# EAGLE design Mirror_ctrl_v1 (EAGLE 7.7.0)
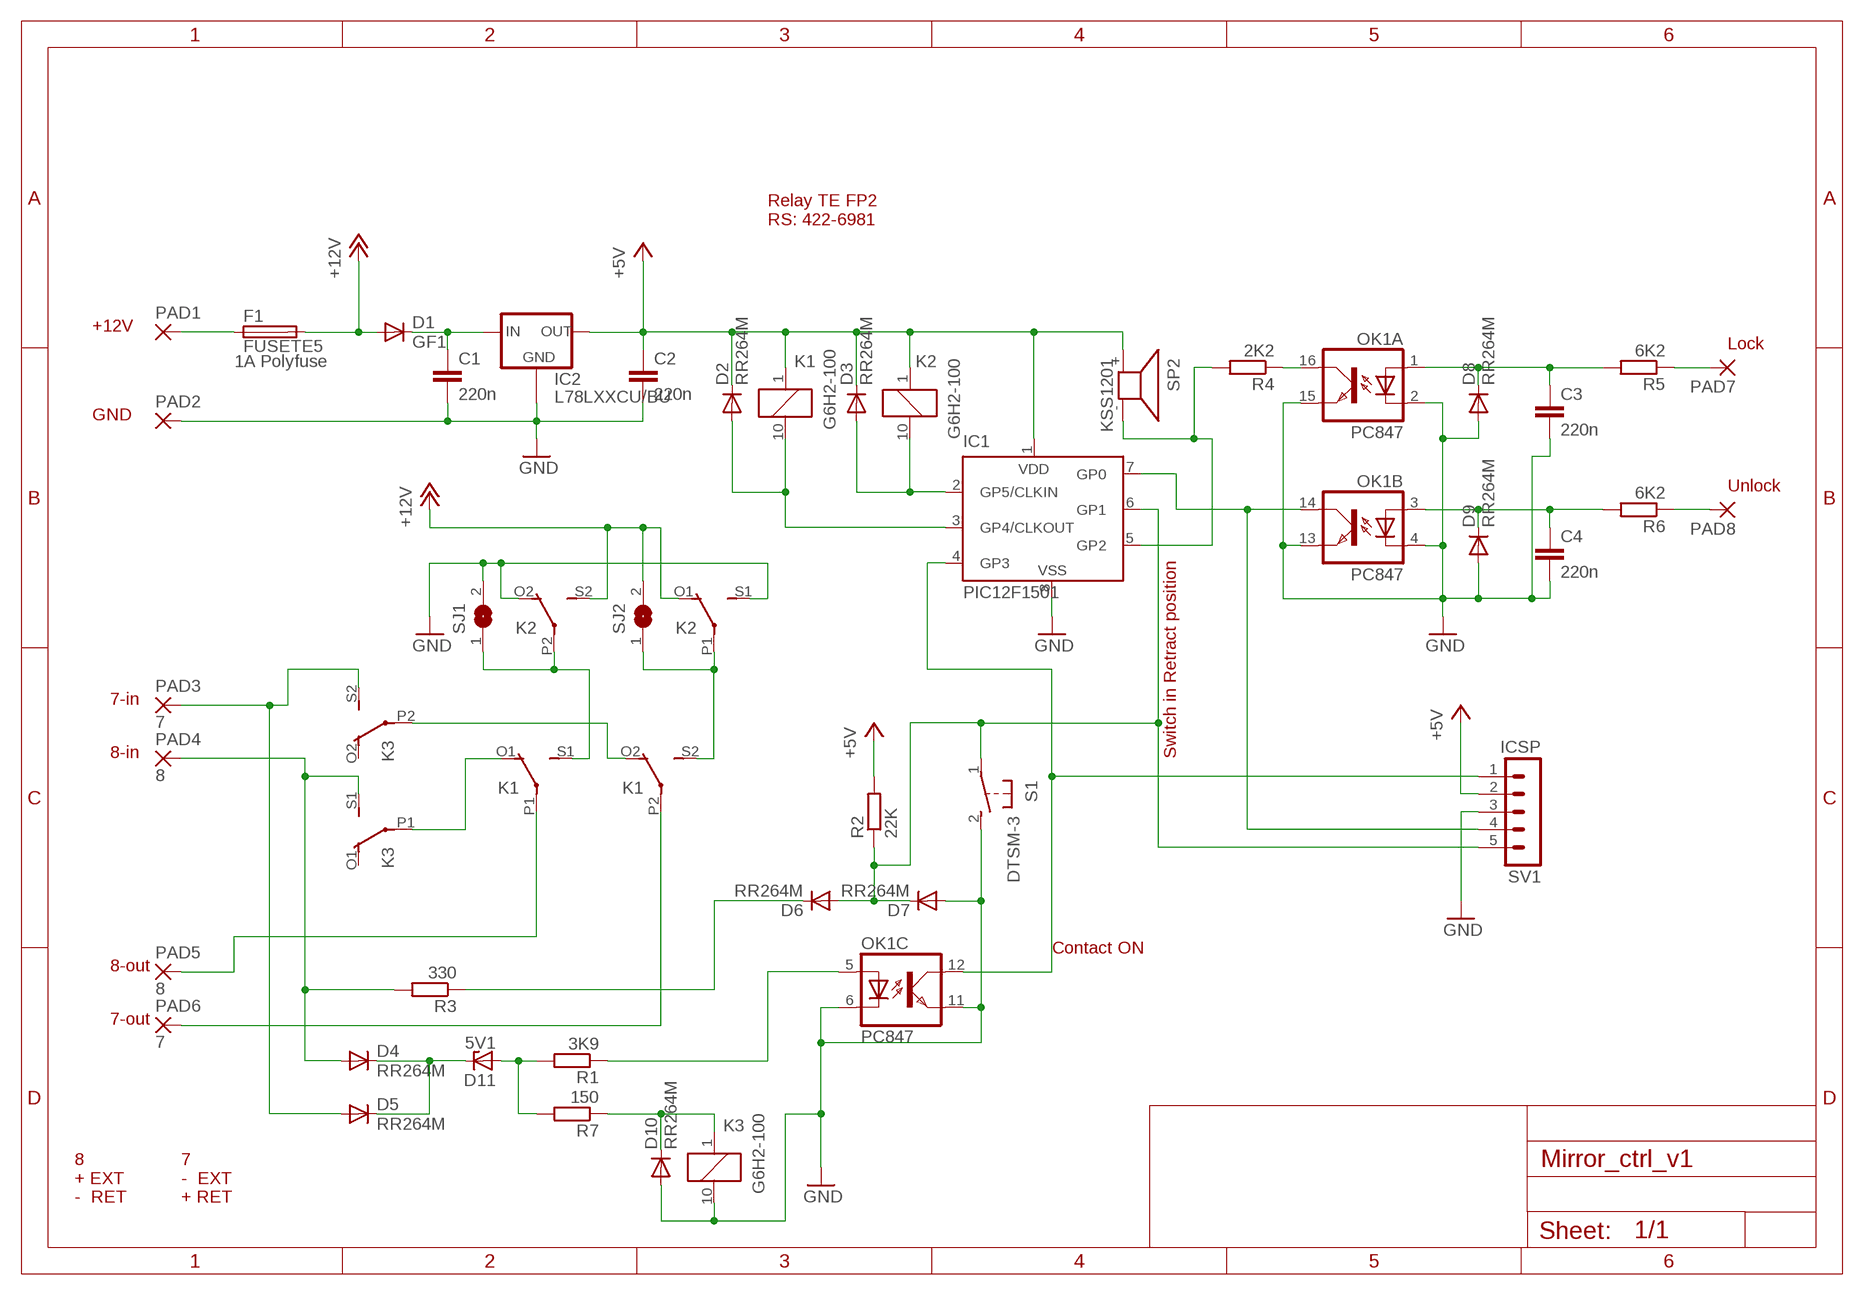
[diagram p0: schematic, sheet 1]

## Parts
C1  220n  C-EUC1206  [C1206]
C2  220n  C-EUC1206  [C1206]
C3  220n  C-EUC1206  [C1206]
C4  220n  C-EUC1206  [C1206]
D1  GF1  DIODE-DO214BA  [DO214BA]
D2  RR264M  CGRM4001-G  [SOD-123_MINI-SMA]
D3  RR264M  CGRM4001-G  [SOD-123_MINI-SMA]
D4  RR264M  CGRM4001-G  [SOD-123_MINI-SMA]
D5  RR264M  CGRM4001-G  [SOD-123_MINI-SMA]
D6  RR264M  CGRM4001-G  [SOD-123_MINI-SMA]
D7  RR264M  CGRM4001-G  [SOD-123_MINI-SMA]
D8  RR264M  CGRM4001-G  [SOD-123_MINI-SMA]
D9  RR264M  CGRM4001-G  [SOD-123_MINI-SMA]
D10  RR264M  CGRM4001-G  [SOD-123_MINI-SMA]
D11  5V1  ZENER-DIODESOD80C  [SOD80C]
F1  FUSETE5  [TE5]
IC1  PIC12F1501  PIC12F675P  [DIL8]
IC2  L78LXXCU/BU  [SOT89]
K1  G6H2-100  [G6H2-100]
K2  G6H2-100  [G6H2-100]
K3  G6H2-100  [G6H2-100]
OK1  PC847  [DIL16]
PAD1  3,81/1,4  [3,81/1,4]
PAD2  3,81/1,4  [3,81/1,4]
PAD3  7  3,81/1,4  [3,81/1,4]
PAD4  8  3,81/1,4  [3,81/1,4]
PAD5  8  3,81/1,4  [3,81/1,4]
PAD6  7  3,81/1,4  [3,81/1,4]
PAD7  3,81/1,4  [3,81/1,4]
PAD8  3,81/1,4  [3,81/1,4]
R1  3K9  R-EU_R1206  [R1206]
R2  22K  R-EU_R1206  [R1206]
R3  330  R-EU_R1206  [R1206]
R4  2K2  R-EU_R1206  [R1206]
R5  6K2  R-EU_R1206  [R1206]
R6  6K2  R-EU_R1206  [R1206]
R7  150  R-EU_R1206  [R1206]
S1  DTSM-3  [DTSM-3]
SJ1  SJ  [SJ]
SJ2  SJ  [SJ]
SP2  KSS1201  [KSS1201]
SV1  ICSP  MA05-1  [MA05-1]

## Nets
+5V: C2.1 D2.C D3.C IC1.1(VDD) IC2.1(OUT) K1.1 K2.1 R2.2 SP2.+ SV1.2
+12V: D1.A F1.2 K2.O1(2:O) K2.S2(3:S) SJ2.2
GND: C1.2 C2.2 C3.2 C4.2 D7.A D8.A D9.A D10.A IC1.8(VSS) IC2.4(GND1) K2.O2(3:O) K2.S1(2:S) K3.10 OK1.2(A:C) OK1.4(B:C) OK1.6(C:C) OK1.11(C:EMIT) OK1.13(B:EMIT) OK1.15(A:EMIT) PAD2.1(P) S1.2 SJ1.2 SV1.3
N$1: D3.A IC1.2(GP5/CLKIN) K2.10
N$2: C1.1 D1.C IC2.3(IN)
N$3: F1.1 PAD1.1(P)
N$4: C3.1 D8.C OK1.1(A:A) R5.2
N$5: D4.A K3.S1(2:S) PAD4.1(P) R3.2
N$6: D5.A K3.S2(3:S) PAD3.1(P)
N$7: K1.P1(2:P) PAD5.1(P)
N$8: K1.P2(3:P) PAD6.1(P)
N$9: PAD7.1(P) R5.1
N$10: D2.A IC1.3(GP4/CLKOUT) K1.10
N$11: OK1.5(C:A) R1.1
N$12: D11.A R1.2 R7.2
N$13: K1.S1(2:S) K2.P2(3:P) SJ1.1
N$14: PAD8.1(P) R6.1
N$15: K1.S2(3:S) K2.P1(2:P) SJ2.1
N$16: C4.1 D9.C OK1.3(B:A) R6.2
N$17: IC1.4(GP3) OK1.12(C:COL) SV1.1
N$18: IC1.7(GP0) OK1.14(B:COL) SV1.4
N$19: OK1.16(A:COL) R4.1
N$20: D6.C R3.1
N$21: IC1.5(GP2) R4.2 SP2.-
N$22: D6.A D7.C IC1.6(GP1) R2.1 S1.1 SV1.5
N$23: K1.O2(3:O) K3.P2(3:P)
N$24: D10.C K3.1 R7.1
N$26: K1.O1(2:O) K3.P1(2:P)
N$28: D4.C D5.C D11.C
Unconnected: IC2.2(GND) K3.O1(2:O) K3.O2(3:O) OK1.7(D:A) OK1.8(D:C) OK1.9(D:EMIT) OK1.10(D:COL)

## Notes on the sheet
- Relay TE FP2
  RS: 422-6981
- +12V
- Lock
- 1A Polyfuse
- GND
- Unlock
- 7-in
- 8-in | Switch in Retract position
- Contact ON
- 8-out
- 7-out
- 8
  + EXT
  -  RET
- 7
  -  EXT
  + RET

## Library data of the parts
C1-C4 = rcl:C-EU: CAPACITOR, European symbol
D1 = diode:DIODE-: DIODE
D2-D10 = diode:CGRM400*-G: Molded plasitc,JEDEC SOD-123/Mini SMA Source: Comchip CGRM4001-G.pdf
D11 = diode:ZENER-DIODE: Z-Diode
F1 = fuse:FUSE: Fuse; OC_FARNELL: unknown; OC_NEWARK: unknown
IC1 = microchip:PIC12F6*: Data Sheet 8-Pin FLASH-Based 8-Bit CMOS Microcontrollers Source: http://www.microchip.com .. 41190c.pdf; MF: MICROCHIP; MPN: PIC12F675-E/P; OC_FARNELL: 9759018; OC_NEWARK: 92C4340
IC2 = v-reg-2:L78LXXCU/BU: VOLTAGE REGULATOR
K1-K3 = relay:G6H2-100: RELAY 2 x switch, 0.5 A/125 V AC, 1 A/30 V DC, Omron; OC_FARNELL: unknown; OC_NEWARK: unknown
OK1 = optocoupler:PC847: SHARP OPTO COUPLER; OC_FARNELL: 9707735; OC_NEWARK: unknown
PAD1-PAD8 = wirepad:3,81/1,4: THROUGH-HOLE PAD
R1-R7 = rcl:R-EU_: RESISTOR, European symbol
S1 = switch-tact:DTSM-3
SJ1 SJ2 = jumper:SJ: SMD solder JUMPER
SP2 = buzzer:KSS1201: SPEAKER Source: Schukat; OC_FARNELL: unknown; OC_NEWARK: unknown
SV1 = con-lstb:MA05-1: PIN HEADER; OC_FARNELL: unknown; OC_NEWARK: unknown

## Board
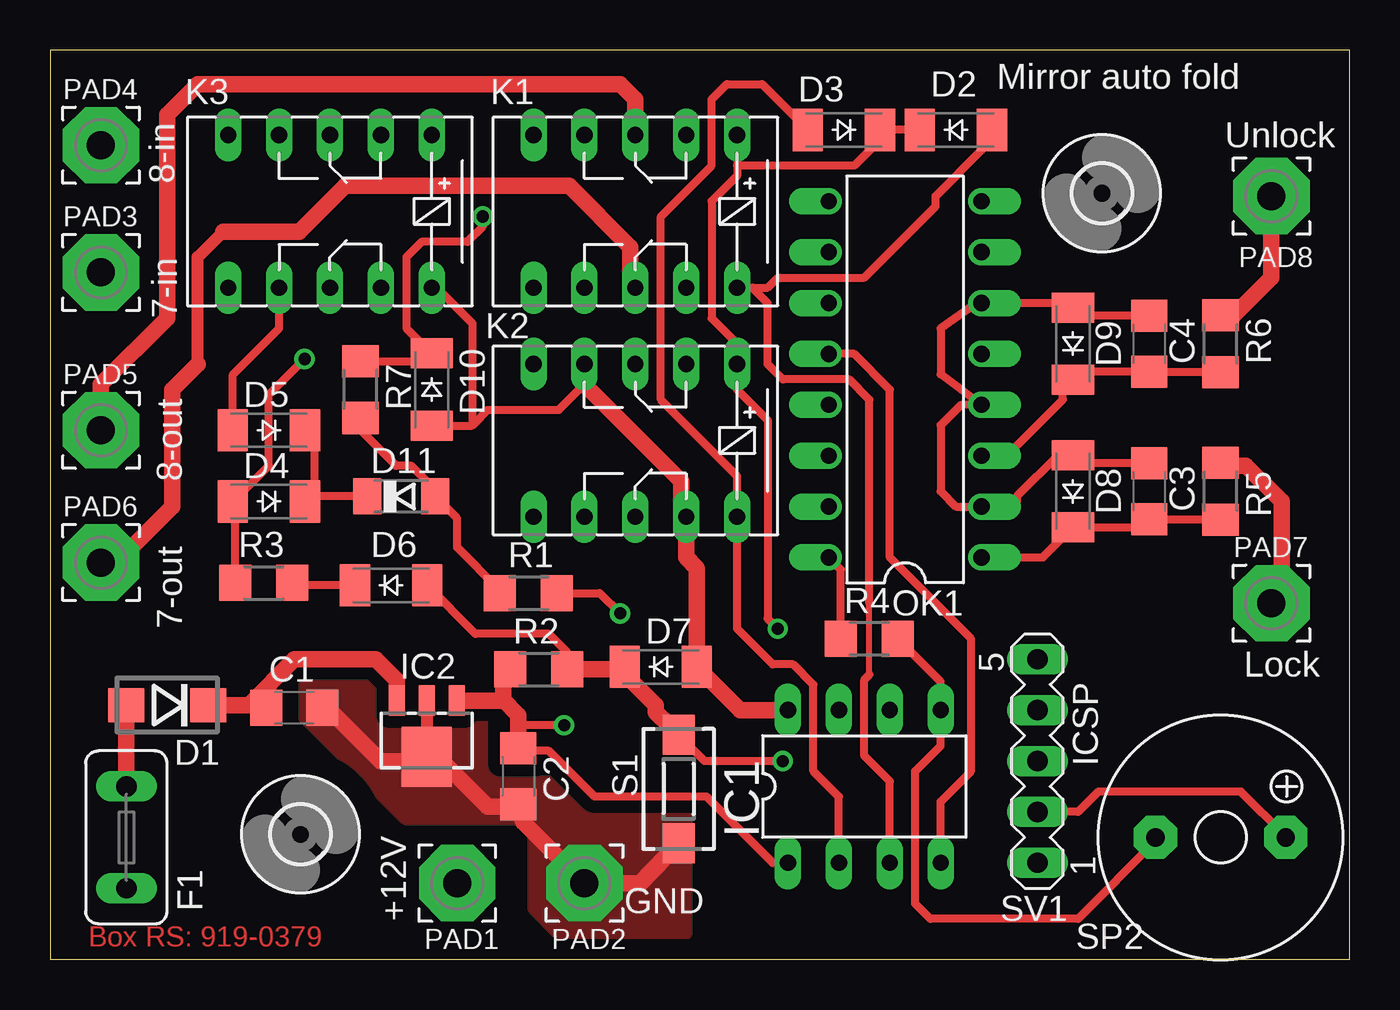
[diagram p1: board, top side]
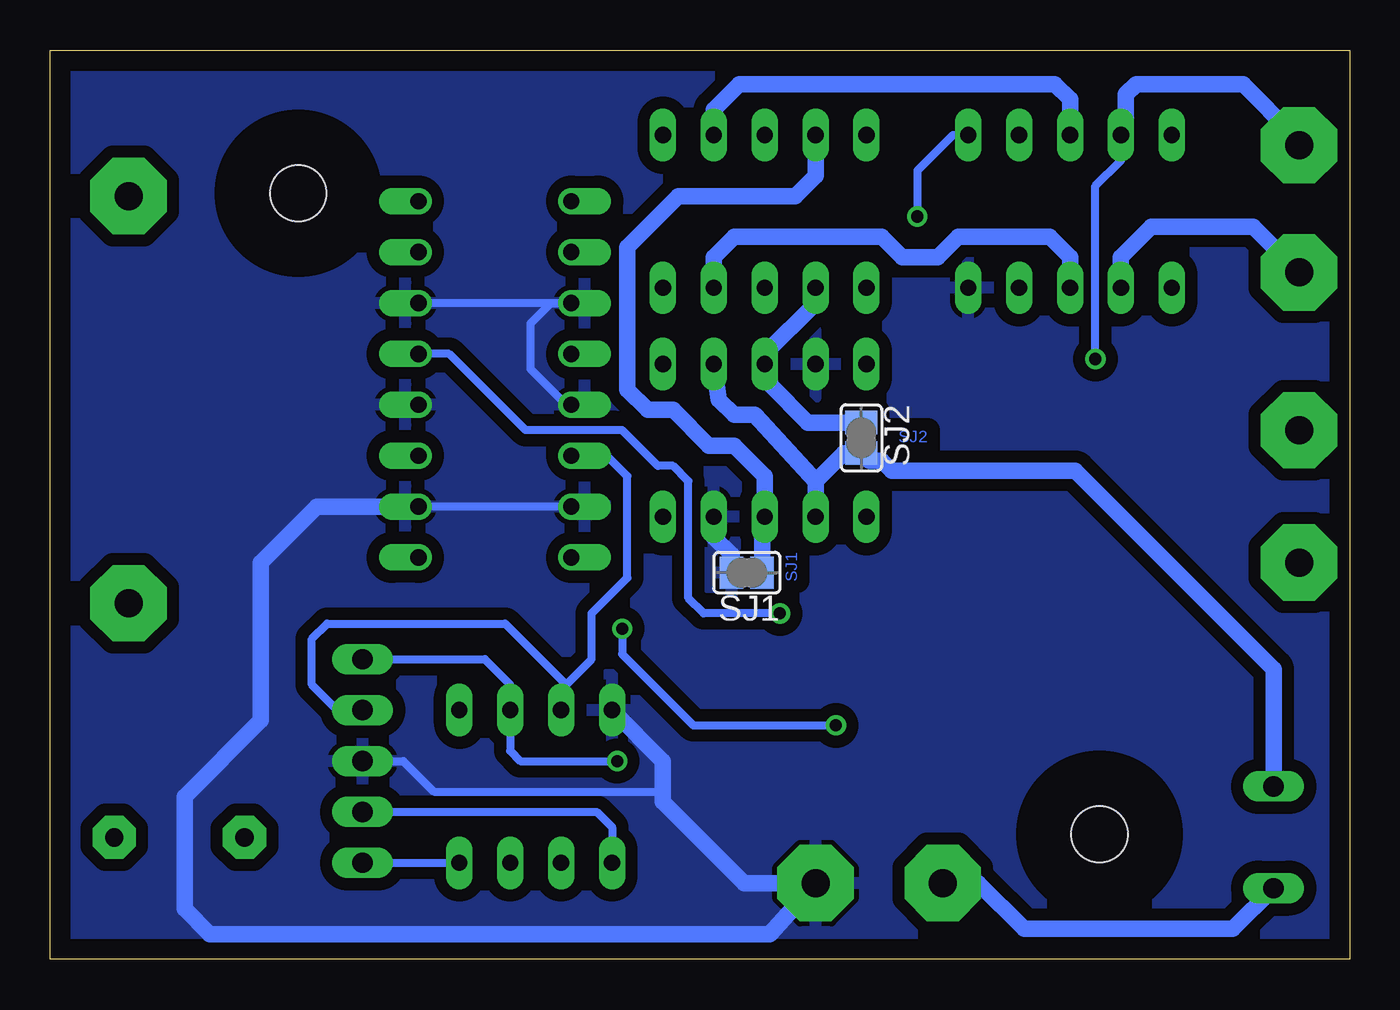
[diagram p2: board, bottom side, seen from below]

Size 64.88 x 45.39 mm. Coordinates in mm from the lower left corner, seen from the top.
Outline: 0,0 64.88,0 64.88,45.39 0,45.39 0,0
Copper layers (1*16): Top 0.035mm / dielectric 1.5mm / Bottom 0.035mm
Design rules "default": minimum track width 10mil, minimum drill 24mil, track to track 8mil, track to pad 8mil, pad to pad 8mil, via to via 8mil, smd to smd 8mil, copper to edge 40mil, drill to drill 8mil, minimum pad ring 10mil, minimum via ring 8mil, stop-mask expansion 4mil, vias tented up to drill 0mil, thermal gap 10mil

### Footprints (pad centres in the part's own frame; a part is rotated, then mirrored left to right if it is on the bottom)
C1206 = smd 1.6 x 1.8: 1 -1.4,0; 2 1.4,0
DO214BA = smd 1.8 x 1.7: A 2.05,0; C -2.05,0
SOD-123_MINI-SMA = smd 1.5 x 2.1: A 1.8,0; C -1.8,0
SOD80C = smd 1.4 x 1.8: A 1.7,0; C -1.7,0
TE5 = drill 1.016 long: 1 -2.54,0; 2 2.54,0
DIL8 = drill 0.813 long: 1 -3.81,-3.81; 2 -1.27,-3.81; 3 1.27,-3.81; 4 3.81,-3.81; 5 3.81,3.81; 6 1.27,3.81; 7 -1.27,3.81; 8 -3.81,3.81
SOT89 = smd 0.8 x 1.5: 1 -1.5,-1.75; 2 0,-1.75; 3 1.5,-1.75 | smd 2.5 x 3: 4 0,1.05
G6H2-100 = drill 0.813 long: 1 -5.08,-3.81; 5 5.08,-3.81; 6 5.08,3.81; 10 -5.08,3.81; O1 -2.54,-3.81; O2 -2.54,3.81; P1 0,-3.81; P2 0,3.81; S1 2.54,-3.81; S2 2.54,3.81
DIL16 = drill 0.813 offset: 1 -8.89,-3.81; 2 -6.35,-3.81; 3 -3.81,-3.81; 4 -1.27,-3.81; 5 1.27,-3.81; 6 3.81,-3.81; 7 6.35,-3.81; 8 8.89,-3.81; 9 8.89,3.81; 10 6.35,3.81; 11 3.81,3.81; 12 1.27,3.81; 13 -1.27,3.81; 14 -3.81,3.81; 15 -6.35,3.81; 16 -8.89,3.81
3,81/1,4 = drill 1.397 pad 3.81 octagon: 1 0,0
R1206 = smd 1.6 x 1.803: 1 -1.422,0; 2 1.422,0
DTSM-3 = smd 2 x 1.6: 1 -2.7,0; 2 2.7,0
SJ = smd 1.168 x 1.6: 1 -0.762,0; 2 0.762,0
KSS1201 = drill 0.914 pad 2.159 octagon: + 3.251,0; - -3.251,0
MA05-1 = drill 1.016 long: 1 -5.08,0; 2 -2.54,0; 3 0,0; 4 2.54,0; 5 5.08,0
2,8 = hole 2.8: 0,0

### Placement (x,y rotation side)
C1  12.19,12.57 0 top
C2  23.37,9.14 270 top
C3  54.86,23.37 90 top
C4  54.86,30.73 90 top
D1  5.84,12.7 180 top
D2  45.21,41.4 0 top
D3  39.62,41.4 180 top
D4  10.92,22.86 180 top
D5  10.92,26.42 180 top
D6  17.02,18.67 0 top
D7  30.48,14.61 0 top
D8  51.05,23.37 90 top
D9  51.05,30.73 90 top
D10  19.05,28.45 270 top
D11  17.53,23.11 0 top
F1  3.81,6.1 90 top
IC1  40.64,8.64 0 top
IC2  18.8,11.18 180 top
K1  29.21,37.34 180 top
K2  29.21,25.91 180 top
K3  13.97,37.34 180 top
OK1  42.67,28.96 90 top
PAD1  20.32,3.81 0 top
PAD2  26.67,3.81 0 top
PAD3  2.54,34.29 0 top
PAD4  2.54,40.64 0 top
PAD5  2.54,26.42 0 top
PAD6  2.54,19.81 0 top
PAD7  60.96,17.78 0 top
PAD8  60.96,38.1 0 top
R1  23.88,18.29 180 top
R2  24.38,14.48 180 top
R3  10.67,18.8 180 top
R4  40.89,16 0 top
R5  58.42,23.37 270 top
R6  58.42,30.73 270 top
R7  15.49,28.45 270 top
S1  31.37,8.51 270 top
SJ1  30.1,19.3 180 bottom
SJ2  24.38,26.04 270 bottom
SP2  58.42,6.1 0 top
SV1  49.28,9.91 90 top
U$1  [2,8]  12.5,6.25 0 top
U$3  [2,8]  52.5,38.25 0 top

### Tracks (layer width: path | path; a pad name or v marks a point on that pad's centre or on a via)
+5V  (via drill 0.6)
  Top 0.406: IC1.1 36.07,4.83 32.77,8.13 27.18,8.13 24.89,10.41 23.5,10.41 C2.1 | 34.29,39.62 K1.1 34.54,41.4 | 34.29,39.62 34.29,39.12 33.02,37.85 33.02,32 34.29,30.73 K2.1 34.29,28.45 35.81,26.92 35.81,17.02 v36.32,16.51 | v25.65,11.68 23.62,11.68 23.37,11.43 | D2.C D3.C 41.42,40.92 40.13,39.62 34.29,39.62 | SP2.+ 61.67,6.15 59.44,8.38 52.32,8.38 51.31,7.37 SV1.2
  Top 0.813: C2.1 23.37,11.43 23.37,12.19 22.61,12.95 | 22.61,12.95 22.61,14.12 R2.2 | IC2.1 22.58,12.93 22.61,12.95
  Bottom 0.406: SV1.2 37.59,7.37 36.83,6.6 IC1.1 | v36.32,16.51 36.32,15.24 32.77,11.68 v25.65,11.68
+12V
  Top 0.813: F1.2 3.81,12.68 D1.A
  Bottom 0.813: K2.S2 26.67,23.88 | 26.67,23.88 29.72,27.18 30.73,27.18 31.5,27.94 K2.O1 | F1.2 3.81,14.48 13.72,24.38 22.86,24.38 23.37,24.89 24,24.89 SJ2.2 25.27,25.27 26.67,23.88
GND
  Top 0.406: 26.67,28.7 25.4,27.43 21.84,27.43 21.21,26.8 | D10.A 21.06,26.65 21.21,26.8 | K3.10 19.3,33.53 21.08,31.75 21.08,26.92 21.21,26.8 | C4.2 51.2,32.13 D9.A 50.8,32.77 OK1.6 46.23,32.77 44.45,31.5 44.45,29.21 OK1.4 45.47,27.69 44.45,26.67 44.45,23.37 45.21,22.61 OK1.2 48.01,22.61 48.26,22.86 48.26,23.11 50.31,25.17 D8.A 51.2,24.77 C3.2
  Top 0.813: K2.S1 26.67,28.7 31.5,23.88 31.5,22.35 K2.O2 31.75,20.07 32.28,19.54 D7.A 34.44,12.45 IC1.8 | 23.37,7.62 21.84,7.62 19.34,10.13 IC2.4 18.58,9.91 16.51,9.91 13.84,12.57 C1.2 | 23.37,7.62 C2.2 | S1.2 29.46,3.81 PAD2.1 23.62,6.86 23.37,7.62
  Bottom 0.406: SV1.3 47.24,9.91 45.72,8.38 34.54,8.38 34.29,8.64 | OK1.15 OK1.2 | SJ1.2 30.86,20.19 | 31.75,21.08 K2.O2 | OK1.13 39.12,27.69 40.89,29.46 40.89,31.75 39.88,32.77 OK1.11 OK1.6
  Bottom 0.813: IC1.8 34.29,9.91 34.29,8.64 34.29,7.87 30.23,3.81 PAD2.1 28.96,1.27 56.9,1.27 58.17,2.54 58.17,8.13 54.36,11.94 54.36,19.81 51.56,22.61 OK1.2 | 30.86,20.19 31.75,21.08
  pour Bottom (isolate 0.61): 0.64,0.64 64.14,0.64 64.14,44.45 0.64,44.45
  pour Top (isolate 0.61, no thermals): 31.75,1.27 25.4,1.27 24.13,2.54 24.13,6.99 17.78,6.99 12.7,12.06 12.7,15.88 22.86,15.88 24.77,13.97 24.77,10.16 26.04,8.89 31.75,8.89
N$1
  Top 0.406: IC1.2 39.37,8.13 38.1,9.4 38.1,13.72 37.08,14.73 36.07,14.73 34.29,16.51 K2.10 34.29,24.13 30.48,27.94 30.48,37.08 33.02,39.62 33.02,42.93 33.78,43.69 35.54,43.69 D3.A
N$2
  Top 0.813: D1.C 9.91,12.7 | 9.91,12.7 10.66,12.7 C1.1 | IC2.3 17.3,13.95 16.26,14.99 12.19,14.99 9.91,12.7
N$3
  Bottom 0.813: PAD1.1 18.54,3.81 16.26,1.52 5.84,1.52 F1.1
N$4
  Top 0.406: OK1.1 49.55,20.07 D8.C 54.46,21.57 C3.1 58.4,21.97 R5.2
N$5  (via drill 0.6)
  Top 0.406: R3.2 9.25,22.74 D4.A 9.14,22.86 10.92,24.64 10.92,28.19 v12.7,29.97
  Bottom 0.406: v12.7,29.97 12.7,38.61 11.43,39.88 K3.S1
  Bottom 0.813: PAD4.1 2.79,41.15 5.33,43.69 10.67,43.69 11.18,43.18 11.18,41.4 K3.S1
N$6
  Top 0.406: D5.A 9.12,29.19 11.43,31.5 K3.S2
  Bottom 0.813: PAD3.1 4.83,36.58 9.91,36.58 11.43,35.05 K3.S2
N$7
  Top 0.813: PAD5.1 2.54,28.7 5.84,32 5.84,42.16 7.37,43.69 28.45,43.69 29.21,42.93 K1.P1
N$8
  Top 0.61: 7.37,29.72 7.37,35.05 8.64,36.32
  Top 0.813: PAD6.1 3.3,19.81 6.1,22.61 6.1,28.45 7.37,29.72 | 8.64,36.32 12.45,36.32 14.73,38.61 25.91,38.61 28.96,35.56 28.96,33.78 K1.P2
N$9
  Top 0.813: PAD7.1 60.71,18.29 61.47,19.05 61.47,22.86 59.69,24.64 58.57,24.64 R5.1
N$10
  Top 0.305: 40.89,14.22 40.89,17.78
  Top 0.406: IC1.3 41.91,8.89 40.64,10.16 40.64,13.97 40.89,14.22 | 40.89,17.78 40.89,27.94 39.88,28.96 36.58,28.96 35.81,29.72 35.81,32.77 35.05,33.53 K1.10 35.81,33.53 36.32,34.04 40.64,34.04 44.2,37.59 44.2,38.1 46.48,40.39 46.48,40.87 D2.A
N$11  (via drill 0.6)
  Top 0.406: R1.1 27.43,18.29 v28.45,17.27
  Bottom 0.406: v28.45,17.27 32.26,17.27 33.02,18.03 33.02,23.88 33.78,24.64 34.54,24.64 36.32,26.42 41.15,26.42 44.96,30.23 OK1.5
N$12
  Top 0.406: 15.6,26.92 R7.2 15.49,26.42 17.27,24.64 18.03,24.64 19.23,23.45 D11.A 20.32,22.02 20.32,20.57 22.45,18.44 R1.2
N$13
  Bottom 0.406: 29.34,21.97 K2.P2
  Bottom 0.813: K1.S1 26.67,39.12 27.69,38.1 33.53,38.1 36.07,35.56 36.07,28.45 35.05,27.43 33.78,27.43 32,25.65 30.73,25.65 29.21,24.13 K2.P2 | SJ1.1 29.34,21.97
N$14
  Top 0.813: R6.1 59.08,32.16 60.96,34.04 PAD8.1
N$15
  Bottom 0.406: 28.96,29.46 K2.P1
  Bottom 0.813: K2.P1 29.21,30.23 26.67,32.77 K1.S2 | SJ2.1 27.05,26.8 28.96,28.7 28.96,29.46
N$16
  Top 0.406: OK1.3 47.75,25.15 50.55,27.94 50.55,28.68 D9.C 51.2,29.33 C4.1 58.4,29.33 R6.2
N$17
  Top 0.406: IC1.4 44.45,7.87 45.97,9.4 45.97,16 41.91,20.07 41.91,28.45 40.13,30.23 OK1.12
  Bottom 0.406: SV1.1 IC1.4
N$18
  Bottom 0.406: IC1.7 39.37,13.46 39.12,13.72 | 39.12,13.72 37.85,14.99 37.85,17.27 36.07,19.05 36.07,24.13 37.08,25.15 OK1.14 | SV1.4 50.55,12.45 51.82,13.72 51.82,16 51.05,16.76 42.16,16.76 39.12,13.72
N$19
  Top 0.406: R4.1 39.47,19.46 OK1.16
N$20
  Top 0.406: D6.C 12.22,18.67 R3.1
N$21
  Top 0.406: R4.2 44.45,13.87 IC1.5 44.45,10.67 43.18,9.4 43.18,2.79 43.94,2.03 51.31,2.03 55.17,5.89 SP2.-
N$22  (via drill 0.6)
  Top 0.406: R2.1 25.81,15.34 24.89,16.26 21.23,16.26 D6.A | 30.89,11.68 S1.1 32.67,9.91 v36.58,9.91
  Top 0.813: 30.89,11.68 30.23,12.35 30.23,12.7 28.68,14.25 D7.C 28.55,14.48 R2.1
  Bottom 0.406: SV1.5 43.18,14.99 41.91,13.72 IC1.6 41.91,10.41 41.4,9.91 v36.58,9.91
N$23
  Bottom 0.813: K3.P2 13.97,35.05 14.99,36.07 19.56,36.07 20.57,35.05 22.35,35.05 23.37,36.07 30.73,36.07 31.75,35.05 K1.O2
N$24  (via drill 0.6)
  Top 0.406: R7.1 18.67,29.87 D10.C 17.78,31.52 17.78,35.05 18.54,35.81 20.83,35.81 21.59,36.58 v21.59,37.08
  Bottom 0.406: K3.1 19.81,41.15 21.59,39.37 v21.59,37.08
N$26
  Bottom 0.813: K3.P1 13.97,42.93 14.73,43.69 30.48,43.69 31.75,42.42 K1.O1
N$27
  Top 0.61: 18.8,12.7 18.8,10.92
N$28
  Top 0.406: 13.21,22.37 D4.C 12.98,23.11 13.21,23.11 | 13.21,23.11 13.21,25.93 D5.C | D11.C 13.21,23.11

### Text on the board
Top: Box RS: 919-0379
Bottom: SJ2 | SJ1
tNames: Mirror auto fold | Unlock | 8-in | 7-in | 8-out | 7-out | Lock | ICSP | GND | +12V